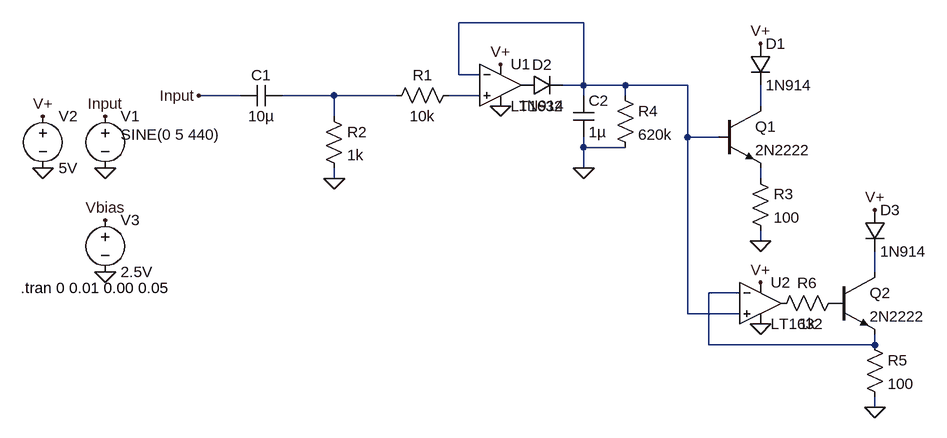
[diagram p0: schematic PeakDetectorForCompressor.asc]
PeakDetectorForCompressor.asc, the LTspice schematic file:
Version 4
SHEET 1 1240 680
WIRE 704 -64 512 -64
WIRE 512 16 512 -64
WIRE 544 16 512 16
WIRE 704 32 704 -64
WIRE 704 32 672 32
WIRE 768 32 704 32
WIRE 864 32 768 32
WIRE 176 48 112 48
WIRE 320 48 240 48
WIRE 416 48 320 48
WIRE 544 48 496 48
WIRE 704 48 704 32
WIRE 768 48 768 32
WIRE 976 64 976 32
WIRE 320 80 320 48
WIRE 864 112 864 32
WIRE 912 112 864 112
WIRE 704 128 704 112
WIRE 768 128 704 128
WIRE 704 160 704 128
WIRE 320 176 320 160
WIRE 976 176 976 160
WIRE 976 272 976 256
WIRE 1152 320 1152 288
WIRE 944 352 896 352
WIRE 864 384 864 112
WIRE 944 384 864 384
WIRE 896 432 896 352
WIRE 1152 432 1152 416
WIRE 1152 432 896 432
WIRE 1152 528 1152 512
FLAG -32 160 0
FLAG -32 80 Input
FLAG -128 160 0
FLAG -128 80 V+
FLAG -32 320 0
FLAG -32 240 Vbias
FLAG 976 272 0
FLAG 976 -32 V+
FLAG 576 64 0
FLAG 576 0 V+
FLAG 112 48 Input
FLAG 704 160 0
FLAG 320 176 0
FLAG 1152 528 0
FLAG 1152 224 V+
FLAG 976 400 0
FLAG 976 336 V+
SYMBOL voltage -32 64 R0
WINDOW 3 24 44 Left 2
WINDOW 123 0 0 Left 0
WINDOW 39 0 0 Left 0
SYMATTR InstName V1
SYMATTR Value SINE(0 5 440)
SYMBOL voltage -128 64 R0
WINDOW 123 0 0 Left 0
WINDOW 39 0 0 Left 0
SYMATTR InstName V2
SYMATTR Value 5V
SYMBOL voltage -32 224 R0
WINDOW 123 0 0 Left 0
WINDOW 39 0 0 Left 0
SYMATTR InstName V3
SYMATTR Value 2.5V
SYMBOL cap 240 32 R90
WINDOW 0 0 32 VBottom 2
WINDOW 3 32 32 VTop 2
SYMATTR InstName C1
SYMATTR Value 10µ
SYMBOL Opamps\\LT1632 576 -32 R0
SYMATTR InstName U1
SYMBOL npn 912 64 R0
SYMATTR InstName Q1
SYMATTR Value 2N2222
SYMBOL res 960 160 R0
SYMATTR InstName R3
SYMATTR Value 100
SYMBOL diode 960 -32 R0
SYMATTR InstName D1
SYMATTR Value 1N914
SYMBOL diode 608 48 R270
WINDOW 0 32 32 VTop 2
WINDOW 3 0 32 VBottom 2
SYMATTR InstName D2
SYMATTR Value 1N914
SYMBOL cap 688 48 R0
SYMATTR InstName C2
SYMATTR Value 1µ
SYMBOL res 752 32 R0
SYMATTR InstName R4
SYMATTR Value 620k
SYMBOL res 512 32 R90
WINDOW 0 0 56 VBottom 2
WINDOW 3 32 56 VTop 2
SYMATTR InstName R1
SYMATTR Value 10k
SYMBOL res 304 64 R0
SYMATTR InstName R2
SYMATTR Value 1k
SYMBOL npn 1088 320 R0
SYMATTR InstName Q2
SYMATTR Value 2N2222
SYMBOL res 1136 416 R0
SYMATTR InstName R5
SYMATTR Value 100
SYMBOL diode 1136 224 R0
SYMATTR InstName D3
SYMATTR Value 1N914
SYMBOL Opamps\\LT1632 976 304 R0
SYMATTR InstName U2
SYMBOL res 1104 352 R90
WINDOW 0 0 56 VBottom 2
WINDOW 3 32 56 VTop 2
SYMATTR InstName R6
SYMATTR Value 1k
TEXT -162 344 Left 2 !.tran 0 0.01 0.00 0.05

The netlist it stands for:
* PeakDetectorForCompressor.asc
V1 Input 0 SINE(0 5 440)
V2 V+ 0 5V
V3 Vbias 0 2.5V
C1 N002 Input 10µ
XU1 N003 N001 V+ 0 P001 LT1632  ; pins In+ In- V+ V- OUT
Q1 N004 N001 N005 0 2N2222
R3 N005 0 100
D1 V+ N004 1N914
D2 P001 N001 1N914
C2 N001 0 1µ
R4 N001 0 620k
R1 N003 N002 10k
R2 N002 0 1k
Q2 N006 P002 N007 0 2N2222
R5 N007 0 100
D3 V+ N006 1N914
XU2 N001 N007 V+ 0 P003 LT1632  ; pins In+ In- V+ V- OUT
R6 P002 P003 1k
.model D D
.lib standard.dio
.model NPN NPN
.model PNP PNP
.lib standard.bjt
.tran 0 0.01 0.00 0.05
.lib LTC.lib
.backanno
.end